# Altium schematic sheet 1_P1.schdoc.schdoc
size 497 x 137 mm
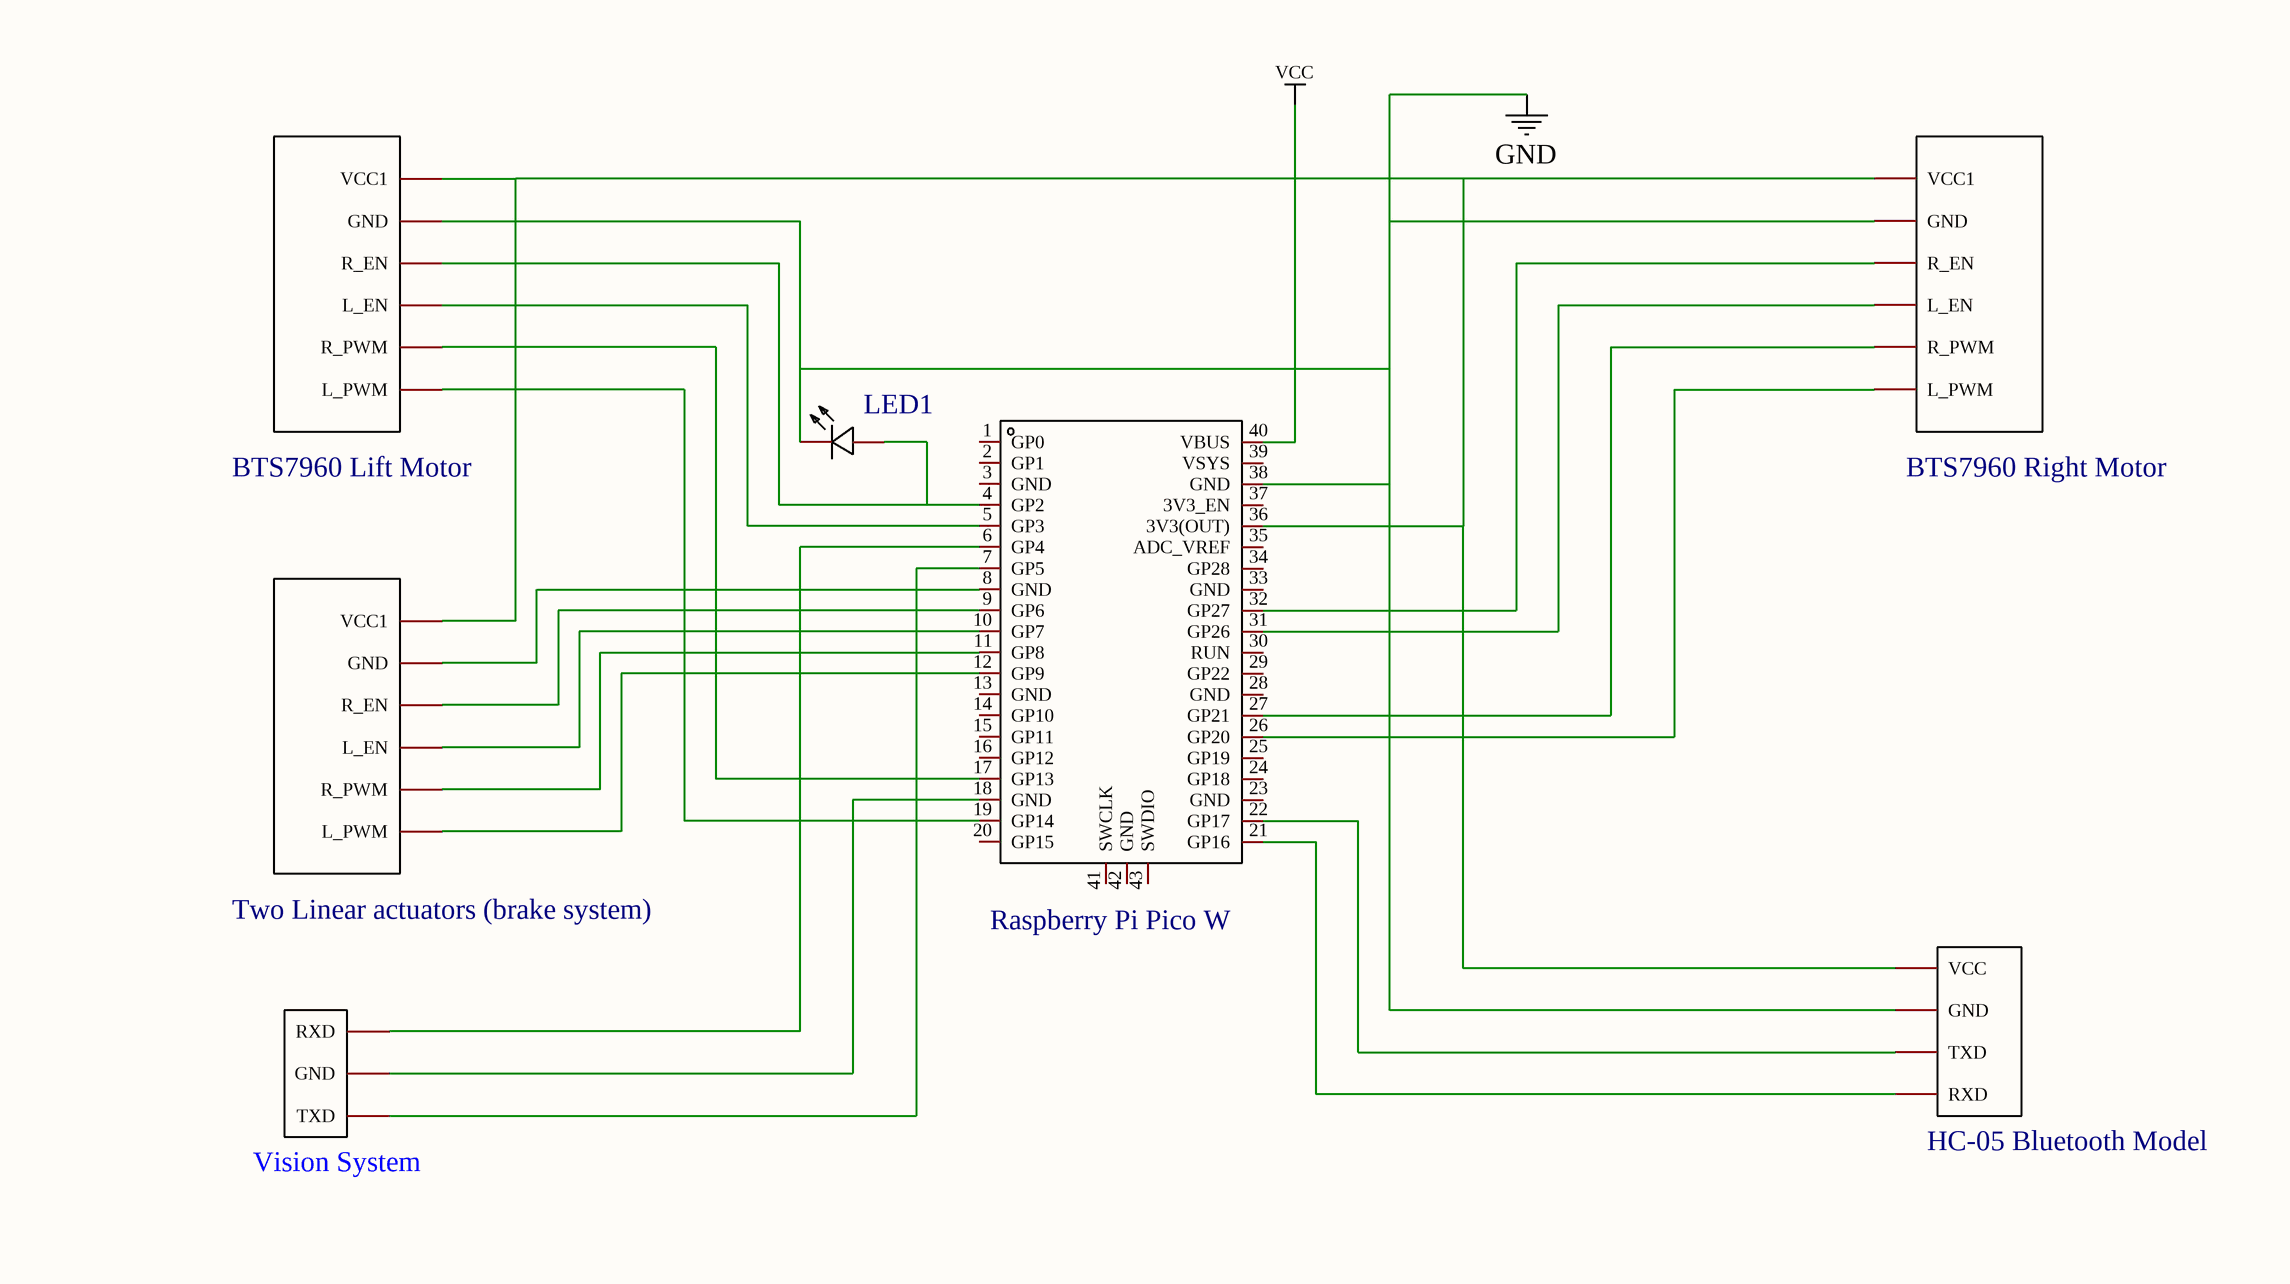
[diagram p0: 1_P1.schdoc.schdoc]

## Parts
LED1  NCD0805R1  [LED0805-R-RD]  (value not drawn)
U1  Raspberry Pi Pico W  [COMM-SMD_L51.0-W21.0-P2.54_SC0916]
U2  HC-05 Bluetooth Model
U3  BTS7960 Lift Motor
U4  BTS7960 Right Motor
U5  Vision System
U6  Two Linear actuators (brake system)

## Nets
GND: LED1.2(-) U1.38(GND) U2.2(GND) U3.2(GND) U4.2(GND)
VCC: U1.40(VBUS)
NetLED1_1: LED1.1(+) U1.4(GP2) U3.3(R_EN)
NetU1_5: U1.5(GP3) U3.4(L_EN)
NetU1_6: U1.6(GP4) U5.1(RXD)
NetU1_7: U1.7(GP5) U5.3(TXD)
NetU1_8: U1.8(GND) U6.2(GND)
NetU1_9: U1.9(GP6) U6.3(R_EN)
NetU1_10: U1.10(GP7) U6.4(L_EN)
NetU1_11: U1.11(GP8) U6.5(R_PWM)
NetU1_12: U1.12(GP9) U6.6(L_PWM)
NetU1_17: U1.17(GP13) U3.5(R_PWM)
NetU1_18: U1.18(GND) U5.2(GND)
NetU1_19: U1.19(GP14) U3.6(L_PWM)
NetU1_21: U1.21(GP16) U2.4(RXD)
NetU1_22: U1.22(GP17) U2.3(TXD)
NetU1_26: U1.26(GP20) U4.6(L_PWM)
NetU1_27: U1.27(GP21) U4.5(R_PWM)
NetU1_31: U1.31(GP26) U4.4(L_EN)
NetU1_32: U1.32(GP27) U4.3(R_EN)
NetU1_36: U1.36(3V3(OUT)) U2.1(VCC) U3.1(VCC1) U4.1(VCC1) U6.1(VCC1)

Not connected (* = marked no-connect by the designer): U1 1(GP0) 2(GP1) 3(GND) 13(GND) 14(GP10) 15(GP11) 16(GP12) 20(GP15) 23(GND) 24(GP18) 25(GP19) 28(GND) 29(GP22) 30(RUN) 33(GND) 34(GP28) 35(ADC_VREF) 37(3V3_EN) 39(VSYS) 41(SWCLK) 42(GND) 43(SWDIO)

## Library data of the parts
LED1 = NCD0805R1: Manufacturer: 国星光电; Symbol: FC-2012HRK-620D; Add into BOM: yes; Emitted Color: 红色; Forward Voltage (VF): 1.6V~2.6V; Power Dissipation: 65mW; Forward Current: 20mA; Dominant Wavelength: 615nm~630nm; Diode Configuration: 独立二极管; Lens Color: 无色透明透镜; Luminous Intensity: 67mcd~195mcd; Viewing Angle: 130°; Description: 灯头类型:-;发光颜色:红色;正向电压(VF):1.6V~2.6V;功率:65mW;正向电流:20mA;主波长:615nm~630nm;二极管配置:独立二极管;透镜颜色:无色透明透镜;色温:-;发光强度:67mcd~195mcd;发光角度:130°;载带方式:-;工作温度:-30℃~+85℃;; Name: NCD0805R1; Device: NCD0805R1; Supplier: LCSC; Manufacturer Part: NCD0805R1; Supplier Part: C84256; JLCPCB Part Class: 基础库; LCSC Part Name: NCD0805R1; Supplier Footprint: 0805; Datasheet: https://atta.szlcsc.com/upload/public/pdf/source/20200820/C84256_F0A75A43B3EAD75808600A0514C76B99.pdf; Convert to PCB: yes; Lamp Holder Type: -; Peak Wavelength: -; Color Temperature: -; Mounting Sytle: -; Operating Temperature: -30℃~+85℃
U1 = PICO: Manufacturer: Raspberry Pi(树莓派); Add into BOM: yes; Description: "基于Raspberry Pi RP2040芯片设计；处理器：双核Arm Cortex-M0+ @ 133MHz内存：264KB片上SRAM；2MB板上QSPI闪存接口：26个GPIO引脚，包括3个模拟输入；2 × UART；2 × SPI控制器；2 × I2C控制器；16个PWM通道；1 × USB 1.1控制器和PHY，支持主机和设备；8 × PIO状态机"; Name: Raspberry Pi Pico W; Symbol: PICO; Device: PICO; Supplier: LCSC; Supplier Part: C7203002; Manufacturer Part: PICO; JLCPCB Part Class: 扩展库; LCSC Part Name: PICO; Supplier Footprint: -; Datasheet: https://atta.szlcsc.com/upload/public/pdf/source/20230906/086376002DDC9866828648BC93E51F8B.pdf; Convert to PCB: yes
U2 = HC-05: Add into BOM: yes; Name: HC-05 Bluetooth Model; Symbol: HC-05; Device: HC-05; Convert to PCB: yes
U3 U4 U6 = Motor Driver: Add into BOM: yes; Symbol: Motor Driver; Device: Motor Driver; Convert to PCB: yes
  U3: Name: BTS7960 Lift Motor
  U4: Name: BTS7960 Right Motor
  U6: Name: Two Linear actuators (brake system)
U5 = Vision System: Add into BOM: yes; Symbol: Vision System; Device: Vision System; Convert to PCB: yes